# EAGLE design Test Board for NCP186-AMX330TAG_v01 (EAGLE 7.7.0)
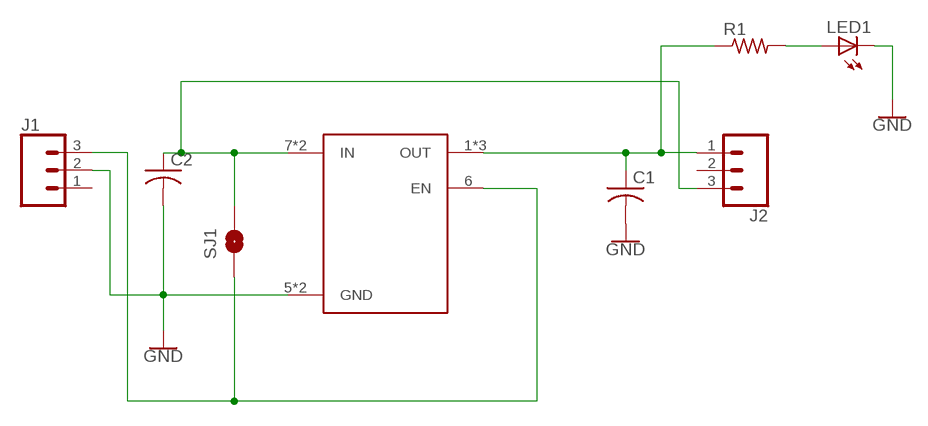
[diagram p0: schematic, sheet 1]

## Parts
C1  C-USC0805K  [C0805K]
C2  C-USC0805K  [C0805K]
J1  CONN_03  [1X03]
J2  CONN_03  [1X03]
LED1  LEDCHIPLED_0603  [CHIPLED_0603]
R1  R-US_R0805W  [R0805W]
SJ1  SOLDERJUMPERNO  [SJ_2S-NO]
U$1  NCP186-AMX330TAG  [XDFN8]

## Nets
EN: J1.3 SJ1.1 U$1.6(EN)
GND: C1.2 C2.2 J1.2 LED1.C U$1.5(GND) U$1.PAD(GND)
IIN: C2.1 J2.3 SJ1.2 U$1.7(IN) U$1.8(IN)
N$1: LED1.A R1.2
OUT: C1.1 J2.1 R1.1 U$1.1(OUT) U$1.2(OUT) U$1.4(OUT)
Unconnected: J1.1 J2.2

## Library data of the parts
C1 C2 = resistor:C-US: CAPACITOR, American symbol
J1 J2 = SparkFun-Connectors:CONN_03: Multi connection point. Often used as Generic Header-pin footprint for 0.1 inch spaced/style header connections On any of the 0.1 inch spaced packages, you can populate with these: Break Away Headers - Straight <https://www.sparkfun.com/products/116> (PRT-00116) Break Away Male Headers - Right Angle <https://www.sparkfun.com/products/553> (PRT-00553) Female Headers <https://www.sparkfun.com/products/115> (PRT-00115) Break Away Headers - Machine Pin <https://www.sparkfun.com/products/117> (PRT-00117) Break Away Female Headers - Swiss Machine Pin <https://www.sparkfun.com/products/743> (PRT-00743) Stackable Header - 3 Pin (Female, 0.1") <https://www.sparkfun.com/products/13875> (PRT-13875) For SCREWTERMINALS and SPRING TERMINALS visit here: Screw Terimnals on SparkFun.com <https://www.sparkfun.com/search/results?term=Screw+Terminals> (5mm/3.5mm/2.54mm spacing) This device is also useful as a general connection point to wire up your design to another part of your project. Our various solder wires solder well into these plated through hole pads. Hook-Up Wire - Assortment (Stranded, 22 AWG) <https://www.sparkfun.com/products/11375> (PRT-11375) Hook-Up Wire - Assortment (Solid Core, 22 AWG) <https://www.sparkfun.com/products/11367> (PRT-11367) View the entire wire category on our website here <https://www.sparkfun.com/categories/141> Special notes: Molex polarized connector foot print use with SKU : PRT-08232 with associated crimp pins and housings.
LED1 = led:LED: LED OSRAM: - CHIPLED LG R971, LG N971, LY N971, LG Q971, LY Q971, LO R971, LY R971 LH N974, LH R974 LS Q976, LO Q976, LY Q976 LO Q996 - Hyper CHIPLED LW Q18S LB Q993, LB Q99A, LB R99A - SideLED LS A670, LO A670, LY A670, LG A670, LP A670 LB A673, LV A673, LT A673, LW A673 LH A674 LY A675 LS A676, LA A676, LO A676, LY A676, LW A676 LS A679, LY A679, LG A679 - Hyper Micro SIDELED® LS Y876, LA Y876, LO Y876, LY Y876 LT Y87S - SmartLED LW L88C, LW L88S LB L89C, LB L89S, LG L890 LS L89K, LO L89K, LY L89K LS L896, LA L896, LO L896, LY L896 - TOPLED LS T670, LO T670, LY T670, LG T670, LP T670 LSG T670, LSP T670, LSY T670, LOP T670, LYG T670 LG T671, LOG T671, LSG T671 LB T673, LV T673, LT T673, LW T673 LH T674 LS T676, LA T676, LO T676, LY T676, LB T676, LH T676, LSB T676, LW T676 LB T67C, LV T67C, LT T67C, LS T67K, LO T67K, LY T67K, LW E67C LS E67B, LA E67B, LO E67B, LY E67B, LB E67C, LV E67C, LT E67C LW T67C LS T679, LY T679, LG T679 LS T770, LO T770, LY T770, LG T770, LP T770 LB T773, LV T773, LT T773, LW T773 LH T774 LS E675, LA E675, LY E675, LS T675 LS T776, LA T776, LO T776, LY T776, LB T776 LHGB T686 LT T68C, LB T68C - Hyper Mini TOPLED® LB M676 - Mini TOPLED Santana® LG M470 LS M47K, LO M47K, LY M47K Source: http://www.osram.convergy.de LUXEON: - LUMILED® LXK2-PW12-R00, LXK2-PW12-S00, LXK2-PW14-U00, LXK2-PW14-V00 LXK2-PM12-R00, LXK2-PM12-S00, LXK2-PM14-U00 LXK2-PE12-Q00, LXK2-PE12-R00, LXK2-PE12-S00, LXK2-PE14-T00, LXK2-PE14-U00 LXK2-PB12-K00, LXK2-PB12-L00, LXK2-PB12-M00, LXK2-PB14-N00, LXK2-PB14-P00, LXK2-PB14-Q00 LXK2-PR12-L00, LXK2-PR12-M00, LXK2-PR14-Q00, LXK2-PR14-R00 LXK2-PD12-Q00, LXK2-PD12-R00, LXK2-PD12-S00 LXK2-PH12-R00, LXK2-PH12-S00 LXK2-PL12-P00, LXK2-PL12-Q00, LXK2-PL12-R00 Source: www.luxeon.com KINGBRIGHT: KA-3528ASYC Source: www.kingbright.com
R1 = resistor:R-US_: RESISTOR, American symbol
SJ1 = SparkFun-Retired:SOLDERJUMPER: Solder Jumper Standard SMD solder jumper. Used to automate production. Two varients : Normally Open and Normally Closed are the same, but have different paste layers. NC will have a large amount of paste and should jumper during reflow.
U$1 = Ladvien_Eagle_Parts:NCP186-AMX330TAG

## Board
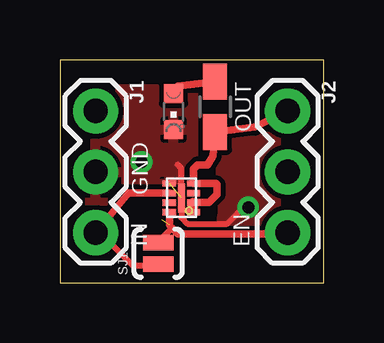
[diagram p1: board, top side]
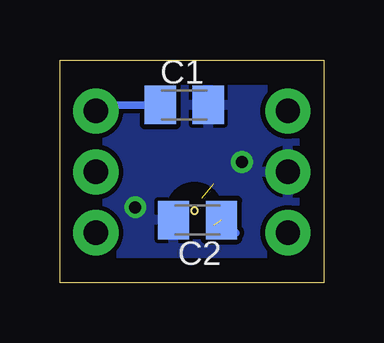
[diagram p2: board, bottom side, seen from below]

Size 11 x 9.3 mm. Coordinates in mm from the lower left corner, seen from the top.
Outline: 0,0 11,0 11,9.3 0,9.3 0,0
Copper layers (1*16): Top 0.035mm / dielectric 1.5mm / Bottom 0.035mm
Design rules "default *": minimum track width 10mil, minimum drill 24mil, track to track 8mil, track to pad 8mil, pad to pad 8mil, via to via 8mil, smd to smd 8mil, copper to edge 40mil, drill to drill 0.5mil, minimum pad ring 10mil, minimum via ring 8mil, stop-mask expansion 4mil, vias tented up to drill 0.5mm, thermal gap 6mil

### Footprints (pad centres in the part's own frame; a part is rotated, then mirrored left to right if it is on the bottom)
C0805K = smd 1.3 x 1.6: 1 -1,0; 2 1,0
1X03 = drill 1.016 pad 1.88: 1 0,0; 2 2.54,0; 3 5.08,0
CHIPLED_0603 = smd 0.8 x 0.8: A 0,-0.75; C 0,0.75
R0805W = smd 1.5 x 1: 1 -1.052,0; 2 1.052,0
SJ_2S-NO = smd 0.635 x 1.27: 1 -0.45,0; 2 0.45,0
XDFN8 = smd 0.26 x 0.55: 1 0.2,0.1; 2 0.6,0.1; 3 1,0.1; 4 1.4,0.1; 5 1.4,1.103; 6 1,1.103; 7 0.6,1.103; 8 0.2,1.103 | smd 1.2 x 0.3: PAD 0.8,0.6

### Placement (x,y rotation side)
C1  5.81,7.42 0 bottom
C2  5.26,2.62 180 bottom
J1  1.49,7.17 270 top
J2  9.5,7.17 270 top
LED1  4.74,7.14 180 top
R1  6.47,7.35 90 top
SJ1  4.1,1.23 90 top
U$1  5.67,2.74 90 top

### Tracks (layer width: path | path; a pad name or v marks a point on that pad's centre or on a via)
EN
  Top 0.254: J1.3 1.67,2.09 3.03,0.73 4.05,0.73 SJ1.1
  Top 0.305: U$1.6 3.74,3.74 3.47,3.75 2.87,3.75 J1.3
GND  (via drill 0.5)  (1 unrouted)
  Top 0.254: 4.92,4.92 5.07,4.77 U$1.PAD 5.07,2.72 5.33,2.46 6.97,2.46 7.79,3.28
  other vias: 3.4,5.04 7.86,3.15
  pour Bottom: 0,9.43 0,0 11.07,0 11.07,9.43
  pour Top: 0,9.43 0,0 11.07,0 11.07,9.43
IIN  (1 unrouted)
  Top 0.254: SJ1.2 4.1,1.7 4.69,2.28
  Top 0.305: U$1.8 4.57,2.4 4.69,2.28 4.92,2.05 9.46,2.05
  Top 0.406: 9.46,2.05 J2.3
  Bottom 0.305: C2.1 4.19,2.62 3.66,2.09
N$1
  Top 0.305: R1.2 4.92,8.2 LED1.A
OUT
  Top 0.305: J2.1 8.12,6.49 R1.1 6.39,5.28 6.15,4.92 5.74,4.92 5.62,4.8 5.57,4.75 U$1.4 6.52,4.14 6.56,4.1 6.56,3.69 6.21,3.34 U$1.2
  Top 0.406: U$1.1 U$1.2
  Bottom 0.305: C1.1 9.25,7.42 J2.1

### Text on the board
tPlace: OUT | GND | IN | EN